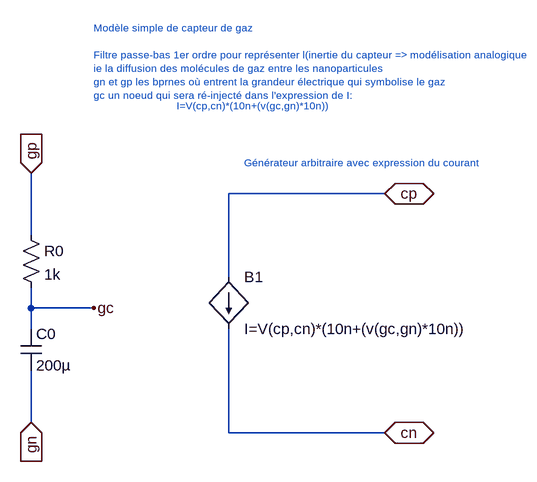
[diagram p0: schematic gaz.asc]
gaz.asc, the LTspice schematic file:
Version 4
SHEET 1 1536 680
WIRE 640 0 400 0
WIRE 96 64 96 -32
WIRE 400 128 400 0
WIRE 96 176 96 144
WIRE 192 176 96 176
WIRE 96 208 96 176
WIRE 96 352 96 272
WIRE 400 368 400 208
WIRE 640 368 400 368
FLAG 640 0 cp
IOPIN 640 0 BiDir
FLAG 640 368 cn
IOPIN 640 368 BiDir
FLAG 96 -32 gp
IOPIN 96 -32 In
FLAG 96 352 gn
IOPIN 96 352 In
FLAG 192 176 gc
SYMBOL res 80 48 R0
SYMATTR InstName R0
SYMATTR Value 1k
SYMBOL cap 80 208 R0
SYMATTR InstName C0
SYMATTR Value 200µ
SYMBOL bi 400 128 R0
SYMATTR InstName B1
SYMATTR Value I=V(cp,cn)*(10n+(v(gc,gn)*10n))
TEXT 192 -256 Left 1 ;Modèle simple de capteur de gaz\n \nFiltre passe-bas 1er ordre pour représenter l(inertie du capteur => modélisation analogique\nie la diffusion des molécules de gaz entre les nanoparticules\ngn et gp les bprnes où entrent la grandeur électrique qui symbolise le gaz\ngc un noeud qui sera ré-injecté dans l'expression de I:
TEXT 424 -48 Left 1 ;Générateur arbitraire avec expression du courant
TEXT 320 -136 Left 1 ;I=V(cp,cn)*(10n+(v(gc,gn)*10n))

The netlist it stands for:
* gaz.asc
R0 gp gc 1k
C0 gc gn 200µ
B1 cp cn I=V(cp,cn)*(10n+(v(gc,gn)*10n))
* Modèle simple de capteur de gaz
* Filtre passe-bas 1er ordre pour représenter l(inertie du capteur => modélisation analogique
* ie la diffusion des molécules de gaz entre les nanoparticules
* gn et gp les bprnes où entrent la grandeur électrique qui symbolise le gaz
* gc un noeud qui sera ré-injecté dans l'expression de I:
* Générateur arbitraire avec expression du courant
* I=V(cp,cn)*(10n+(v(gc,gn)*10n))
.backanno
.end